# Altium schematic sheet Power_Switch.SchDoc
size A4; SheetNumber: 10; SheetTotal: 10
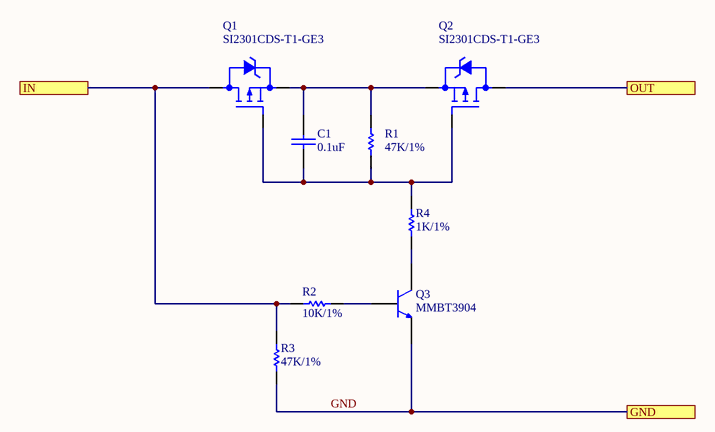
[diagram p0: Power_Switch.SchDoc]

## Parts
C1  0.1uF  [0805-CAP-TDK]
Q1  SI2301CDS-T1-GE3  [VS-SOT-23]
Q2  SI2301CDS-T1-GE3  [VS-SOT-23]
Q3  MMBT3904  [VS-SOT-23]
R1  47K/1%  [0805-RES-PANASONIC]
R2  10K/1%  [0805-RES-PANASONIC]
R3  47K/1%  [0805-RES-PANASONIC]
R4  1K/1%  [0805-RES-PANASONIC]

## Ports
GND, IN, OUT

## Nets
GND: Q3.2(E) R3.1 ; port GND
IN: Q1.3(D) R2.1 R3.2 ; port IN
OUT: Q2.3(D) ; port OUT
NetC1_1: C1.1 Q1.1(G) Q2.1(G) R1.1 R4.2
NetC1_2: C1.2 Q1.2(S) Q2.2(S) R1.2
NetQ3_1: Q3.1(B) R2.2
NetQ3_3: Q3.3(C) R4.1

## Library data of the parts
C1 = CAP-SMD
Q1 Q2 = SI2301CDS-T1-GE3: P-Channel 20 V 3.1A (Tc) 860mW (Ta), 1.6W (Tc) Surface Mount SOT-23-3 (TO-236)
Q3 = MMBT3904: Bipolar (BJT) Transistor NPN 40 V 200 mA 300MHz 350 mW Surface Mount SOT-23
R1-R4 = RES-SMD